# Altium schematic sheet MCU.SchDoc
size A4; SheetNumber: 3; SheetTotal: 7
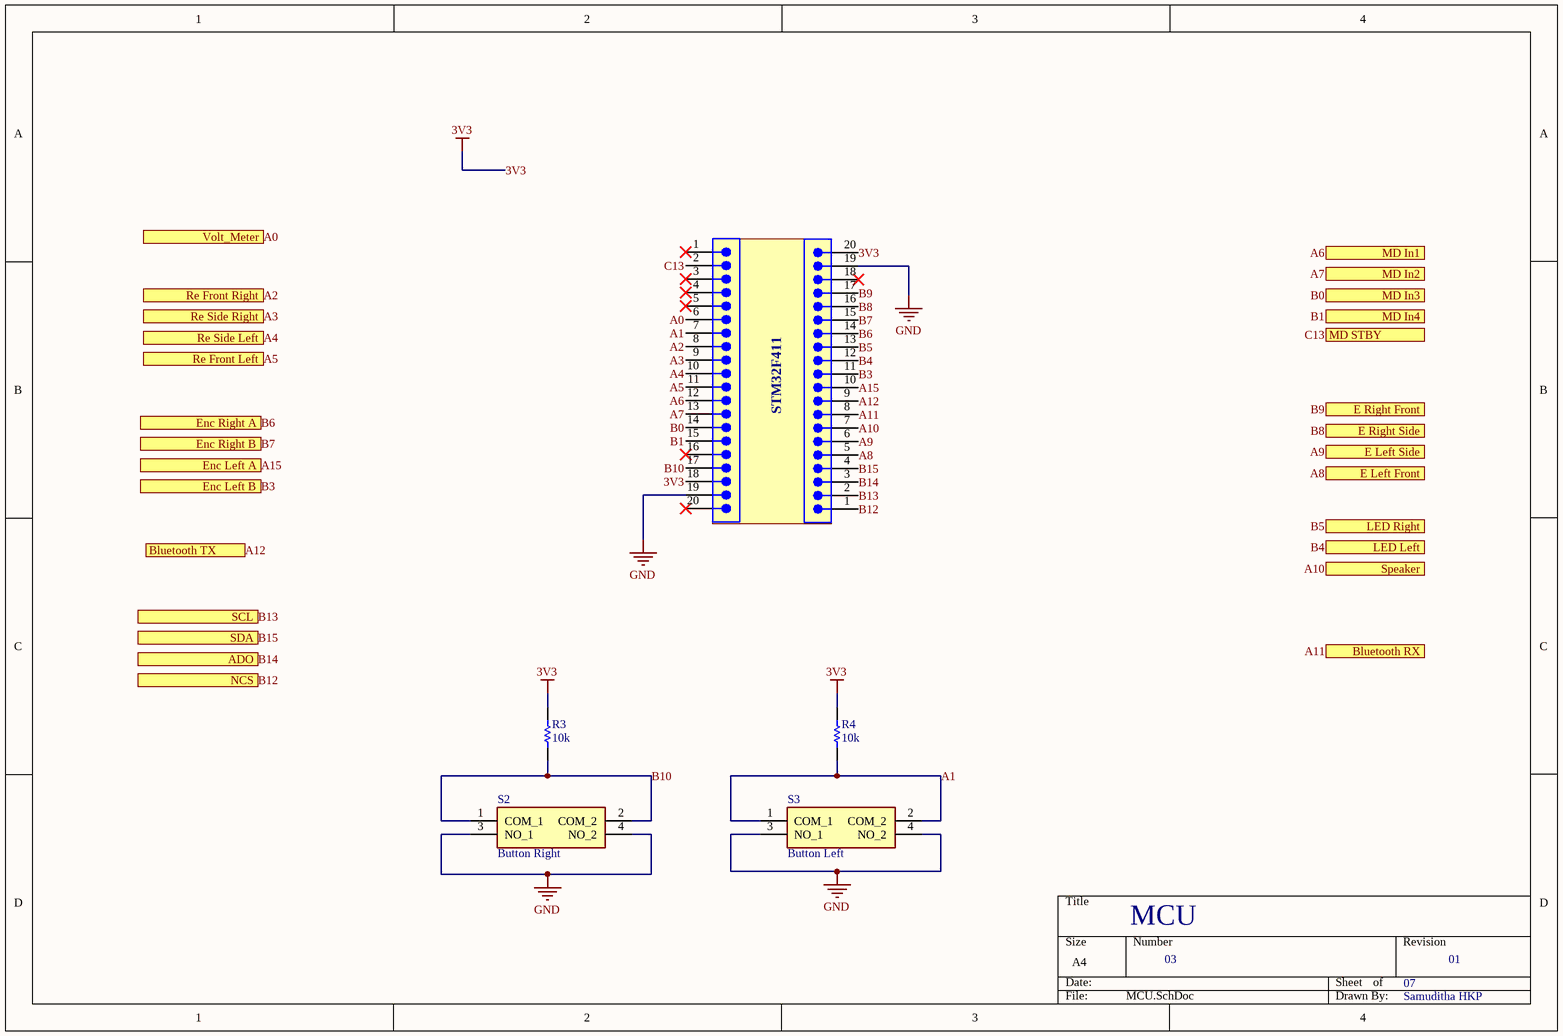
[diagram p0: MCU.SchDoc]

## Parts
P4  61302011121  [61302011121]  (value not drawn)
P5  61302011121  [61302011121]  (value not drawn)
R3  10k  [RESC1005X40X25LL05T10]
R4  10k  [RESC1005X40X25LL05T10]
S2  Button Right  [COM08720]
S3  Button Left  [COM08720]

## Blocks framed on the sheet
STM32F411: P4 P5

## Ports
ADO (in, see Main[2C], Motor and Gyro[4B]), Bluetooth RX (out, see Main[3C], Indicators[1B]), Bluetooth TX (in, see Main[2C], Indicators[4B]), E Left Front (out, see Main[3C], IR Transmitter[1C]), E Left Side (out, see Main[3C], IR Transmitter[1B]), E Right Front (out, see Main[3C], IR Transmitter[1B]), E Right Side (out, see Main[3C], IR Transmitter[1B]), Enc Left A (in, see Main[2C], Motor and Gyro[4C]), Enc Left B (in, see Main[2C], Motor and Gyro[4C]), Enc Right A (in, see Main[2B], Motor and Gyro[4C]), Enc Right B (in, see Main[2C], Motor and Gyro[4C]), LED Left (out, see Main[3C], Indicators[1A]), LED Right (out, see Main[3C], Indicators[1A]), MD In1 (out, see Main[3B], Motor and Gyro[1B]), MD In2 (out, see Main[3B], Motor and Gyro[1B]), MD In3 (out, see Main[3B], Motor and Gyro[1B]), MD In4 (out, see Main[3B], Motor and Gyro[1B]), MD STBY (out, see Main[3B], Motor and Gyro[1C]), NCS (in, see Main[2C]), Re Front Left (in, see Main[2B], IR Receiver[4B]), Re Front Right (in, see Main[2B], IR Receiver[4B]), Re Side Left (in, see Main[2B], IR Receiver[4B]), Re Side Right (in, see Main[2B], IR Receiver[4B]), SCL (in, see Main[2C], Motor and Gyro[4B]), SDA (in, see Main[2C], Motor and Gyro[4B]), Speaker (out, see Main[3C], Indicators[1A]), Volt_Meter (in, see Main[2B], Power[4C])

## Nets
3V3: P4.18 P5.20 R3.2 R4.2
GND: P4.19 P5.19 S2.3(NO_1) S2.4(NO_2) S3.3(NO_1) S3.4(NO_2)
A0: P4.6 ; port Volt_Meter
A1: P4.7 R4.1 S3.1(COM_1) S3.2(COM_2)
A2: P4.8 ; port Re Front Right
A3: P4.9 ; port Re Side Right
A4: P4.10 ; port Re Side Left
A5: P4.11 ; port Re Front Left
A6: P4.12 ; port MD In1
A7: P4.13 ; port MD In2
A8: P5.5 ; port E Left Front
A9: P5.6 ; port E Left Side
A10: P5.7 ; port Speaker
A11: P5.8 ; port Bluetooth RX
A12: P5.9 ; port Bluetooth TX
A15: P5.10 ; port Enc Left A
B0: P4.14 ; port MD In3
B1: P4.15 ; port MD In4
B3: P5.11 ; port Enc Left B
B4: P5.12 ; port LED Left
B5: P5.13 ; port LED Right
B6: P5.14 ; port Enc Right A
B7: P5.15 ; port Enc Right B
B8: P5.16 ; port E Right Side
B9: P5.17 ; port E Right Front
B10: P4.17 R3.1 S2.1(COM_1) S2.2(COM_2)
B12: P5.1 ; port NCS
B13: P5.2 ; port SCL
B14: P5.3 ; port ADO
B15: P5.4 ; port SDA
C13: P4.2 ; port MD STBY

Not connected (* = marked no-connect by the designer): P4 1* 3* 4* 5* 16* 20*; P5 18*

## Notes on the sheet
- MCU
- 03
- 07
- 01
- Samuditha HKP

## Library data of the parts
P4 P5 = CMP-1502-01102-3: NexarPartId: 32855554; Operating Supply Voltage: 250V; Gender: Male; Current Rating: 3A; Contact Resistance: 20mΩ; Number of Contacts: 20; Pitch: 2.54mm; Connector Type: Male Pin; RoHS: Compliant; Contact Plating: Gold; REACH SVHC: Unknown; Packaging: Bulk; Lead Pitch: 2.54mm; Mount: Through Hole; Termination: Solder; Number of Pins: 20; Contact Mating Length: 5.9944mm; Number of Rows: 1; Color: Black; Contact Material: Copper; Orientation: Vertical; Number of Positions: 20
R3 R4 = CMP-2002-07353-1: Part Number: RC0402FR-0710KL; Manufacturer: Yageo / Phycomp
S2 S3 = COM-08720: Switch; Manufacturer_Name: SparkFun; Datasheet Link: https://eu.mouser.com/datasheet/2/813/SMD_Button-2527098.pdf; Height: 1.8mm; Manufacturer_Part_Number: COM-08720; Mouser Part Number: 474-COM-08720; Mouser Price/Stock: https://www.mouser.co.uk/ProductDetail/SparkFun/COM-08720?qs=WyAARYrbSnaaMDwitZjU3A%3D%3D; Arrow Part Number: COM-08720; Arrow Price/Stock: https://www.arrow.com/en/products/com-08720/sparkfun-electronics?region=nac